# Altium project POL.PrjPcb
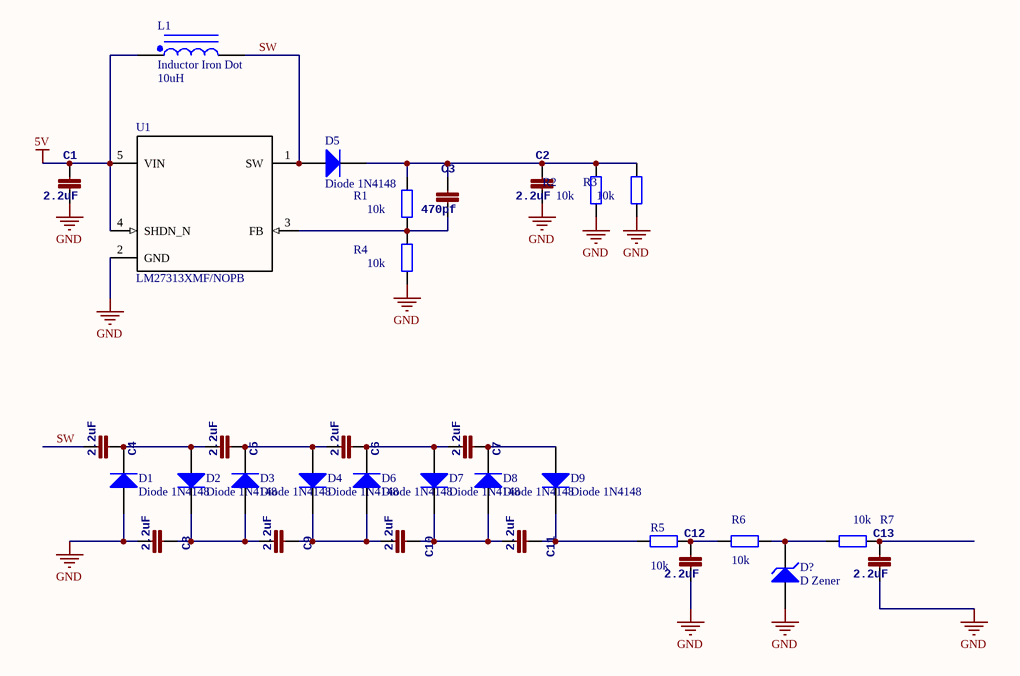
[diagram p0: POL.SchDoc]
1 sheet, 32 parts. Net scope: global (net labels, ports and power ports of the same name join across sheets).
Board file: POL.PcbDoc

## Sheet POL.SchDoc
size A2

### Parts
C1  2.2uF  [0805]
C2  2.2uF  [0805]
C3  470pf  [0402]
C4  2.2uF  [0805]
C5  2.2uF  [0805]
C6  2.2uF  [0805]
C7  2.2uF  [0805]
C8  2.2uF  [0805]
C9  2.2uF  [0805]
C10  2.2uF  [0805]
C11  2.2uF  [0805]
C12  2.2uF  [0805]
C13  2.2uF  [0805]
D1  Diode 1N4148  [LC-SOD-323]
D2  Diode 1N4148  [LC-SOD-323]
D3  Diode 1N4148  [LC-SOD-323]
D4  Diode 1N4148  [LC-SOD-323]
D5  Diode 1N4148  [LC-SOD-323]
D6  Diode 1N4148  [LC-SOD-323]
D7  Diode 1N4148  [LC-SOD-323]
D8  Diode 1N4148  [LC-SOD-323]
D9  Diode 1N4148  [LC-SOD-323]
D?  D Zener  [SMA]
L1  Inductor Iron Dot  value 10uH  [0806]
R1  value 10k  [0402]
R2  value 10k  [0402]
R3  value 10k  [0402]
R4  value 10k  [0402]
R5  value 10k  [0402]
R6  value 10k  [0402]
R7  value 10k  [0402]
U1  LM27313XMF/NOPB  [SOT23-5]

### Nets
5V: C1.2 L1.1 U1.4(SHDN_N) U1.5(VIN)
GND: C1.1 C2.1 C8.1 C12.1 C13.1 D1.1(A) D?.1(A) R2.1 R3.1 R4.1 U1.2(GND)
SW: C4.1 D5.1(A) L1.2 U1.1(SW)
NetC2_2: C2.2 C3.2 D5.2(K) R1.2 R2.2 R3.2
NetC3_1: C3.1 R1.1 R4.2 U1.3(FB)
NetC4_2: C4.2 C5.1 D1.2(K) D2.1(A)
NetC5_2: C5.2 C6.1 D3.2(K) D4.1(A)
NetC6_2: C6.2 C7.1 D6.2(K) D7.1(A)
NetC7_2: C7.2 D8.2(K) D9.1(A)
NetC8_2: C8.2 C9.1 D2.2(K) D3.1(A)
NetC9_2: C9.2 C10.1 D4.2(K) D6.1(A)
NetC10_2: C10.2 C11.1 D7.2(K) D8.1(A)
NetC11_2: C11.2 D9.2(K) R5.2
NetC12_2: C12.2 R5.1 R6.2
NetC13_2: C13.2 R7.1
NetD?_2: D?.2(K) R6.1 R7.2

### Library data of the parts
C1-C13 = CAP0402-CAP: <b>Capacitor</b> / Standard 0603 ceramic capacitor, and 0.1" leaded capacitor.; PARTNO: CC0402ZRY5V7BB104
D1-D9 = Diode 1N4148: High Conductance Fast Diode; Published: 8-Jun-2000; LatestRevisionDate: 17-Jul-2002; LatestRevisionNote: Re-released for DXP Platform.; DatasheetVersion: 1997; PackageReference: DO-35; Publisher: Altium Limited; PackageDescription: Diode, Axial; Body 3.8 x 1.9 mm (LxDia. max), Lead Dia. 0.53 mm (max); Code_JEDEC: DO-204-AH; ComponentLink1Description: Manufacturer Link; ComponentLink1URL: http://www.fairchildsemi.com/; ComponentLink2Description: Datasheet; ComponentLink2URL: http://www.fairchildsemi.com/ds/1N%2F1N4148.pdf
D? = D Zener: Zener Diode; Published: 8-Jun-2000; LatestRevisionDate: 17-Jul-2002; LatestRevisionNote: Re-released for DXP Platform.; PackageReference: DIODE-0.7; Publisher: Altium Limited; PackageDescription: Diode, Thru-Hole; 2 Leads; 0.7 in Pin Spacing
L1 = Inductor Iron Dot: Magnetic-Core Inductor with Winding Polarity Marking; Published: 24-Mar-1999; LatestRevisionDate: 17-Jul-2002; LatestRevisionNote: Re-released for DXP Platform.; PackageReference: DIODE_SMC; Publisher: Altium Limited; PackageDescription: Diode; 2 Leads
R1-R7 = Res2: Resistor; Published: 8-Jun-2000; LatestRevisionDate: 17-Jul-2002; LatestRevisionNote: Re-released for DXP Platform.; PackageReference: AXIAL-0.4; Publisher: Altium Limited; PackageDescription: Axial Device, Thru-Hole; 2 Leads; 0.4 in Pin Spacing
U1 = LM27313XMF/NOPB: Imported; Manufacturer: Texas Instruments; CompType: IC; PIN_COUNT: 5; PartNumber: LM27313XMF/NOPB; PackageReference: DBV0005A; MountType: SMT; RoHS: Y; RefDes: RefDes; Type: DEV; Value: Value